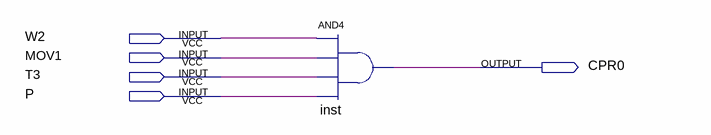
[diagram p0: schematic sheet]
// Quartus schematic CPR0.bdf as structural Verilog: 1 symbols, 5 pins
module CPR0 (
  input  W2,
  input  MOV1,
  input  T3,
  input  P,
  output CPR0
);

  and inst (CPR0, W2, MOV1, T3, P);
endmodule
